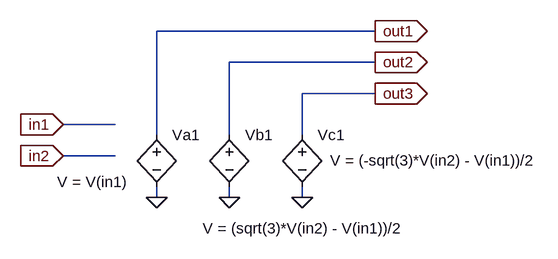
[diagram p0: schematic Rev_Clarke.asc]
Rev_Clarke.asc, the LTspice schematic file:
Version 4
SHEET 1 880 680
WIRE 96 -144 -240 -144
WIRE 96 -96 -128 -96
WIRE 96 -48 -16 -48
WIRE -304 0 -384 0
WIRE -240 16 -240 -144
WIRE -128 16 -128 -96
WIRE -16 16 -16 -48
WIRE -304 48 -384 48
WIRE -240 112 -240 96
WIRE -128 112 -128 96
WIRE -16 112 -16 96
FLAG -384 0 in1
IOPIN -384 0 In
FLAG -384 48 in2
IOPIN -384 48 In
FLAG -240 112 0
FLAG -128 112 0
FLAG 96 -144 out1
IOPIN 96 -144 Out
FLAG 96 -96 out2
IOPIN 96 -96 Out
FLAG -16 112 0
FLAG 96 -48 out3
IOPIN 96 -48 Out
SYMBOL bv -240 0 R0
WINDOW 3 -153 88 Left 2
SYMATTR Value V = V(in1)
SYMATTR InstName Va1
SYMBOL bv -128 0 R0
WINDOW 3 -41 160 Left 2
SYMATTR Value V = (sqrt(3)*V(in2) - V(in1))/2
SYMATTR InstName Vb1
SYMBOL bv -16 0 R0
WINDOW 3 43 55 Left 2
SYMATTR Value V = (-sqrt(3)*V(in2) - V(in1))/2
SYMATTR InstName Vc1

The netlist it stands for:
* Rev_Clarke.asc
B§Va1 out1 0 V = V(in1)
B§Vb1 out2 0 V = (sqrt(3)*V(in2) - V(in1))/2
B§Vc1 out3 0 V = (-sqrt(3)*V(in2) - V(in1))/2
.backanno
.end